# EAGLE design IRC2K16 (EAGLE 6.1)

## Sheet 1 of 2
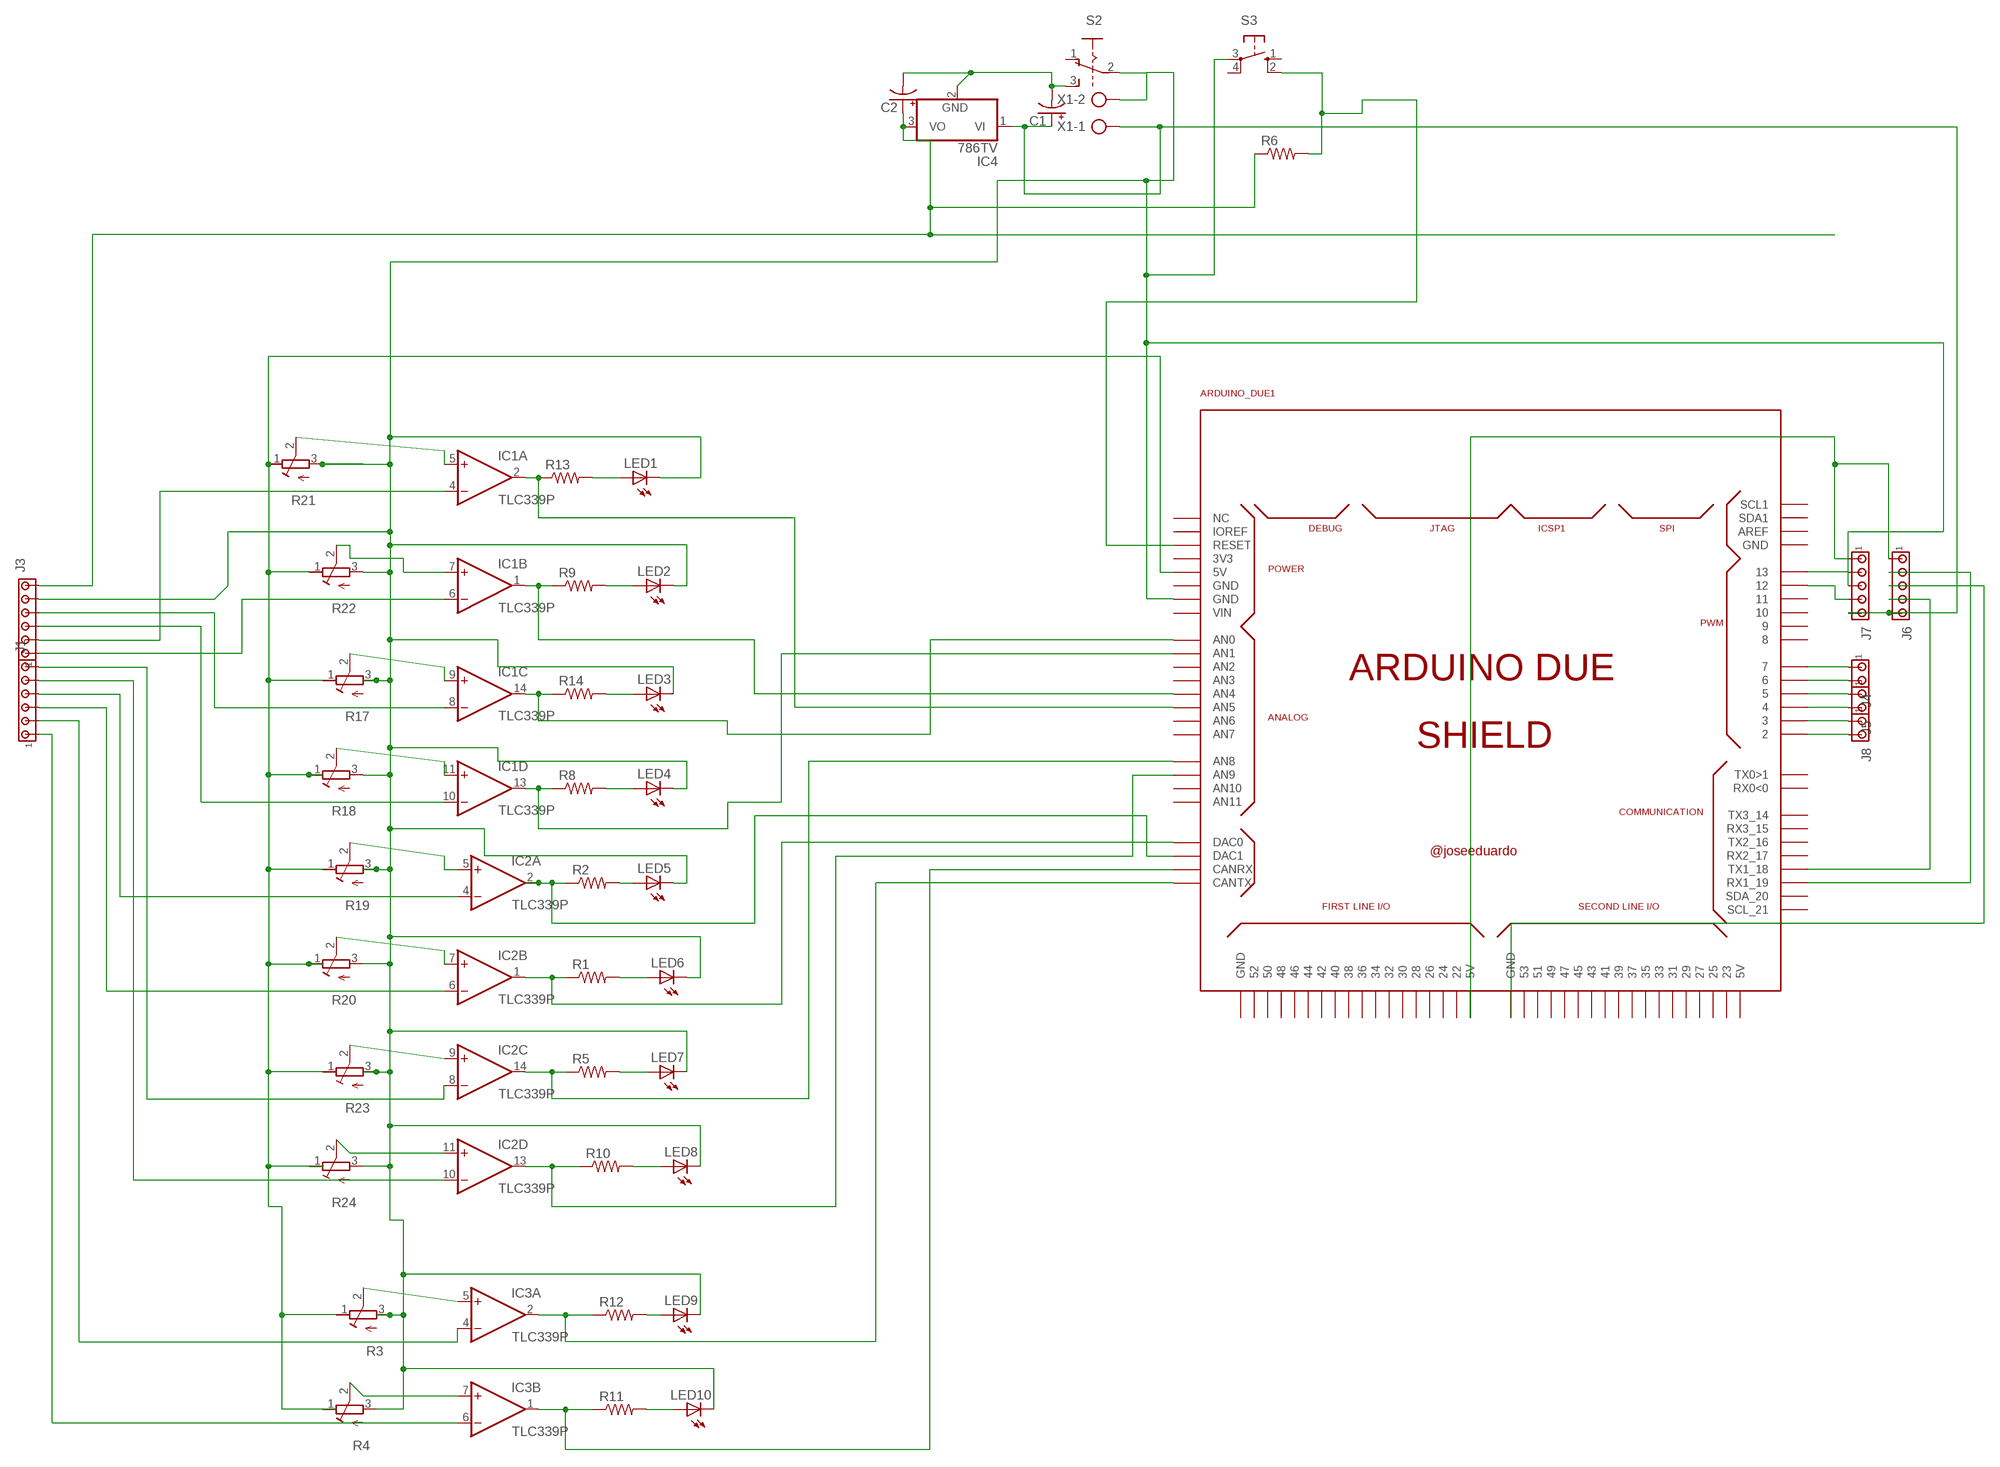
[diagram p0: schematic, sheet 1]

### Parts
ARDUINO_DUE1  ARDUINO_DUE_SHIELD  [ARDUINO_DUE_SHIELD]
C1  CPOL-USE5-10.5  [E5-10,5]
C2  CPOL-USE5-10.5  [E5-10,5]
IC1  TLC339P  [DIL14]
IC2  TLC339P  [DIL14]
IC3  TLC339P  [DIL14]
IC4  786TV  [TO220V]
J1  MTA06-100  [10X06MTA]
J3  MTA06-100  [10X06MTA]
J4  MTA02-100  [10X02MTA]
J5  MTA02-100  [10X02MTA]
J6  MTA05-100  [10X05MTA]
J7  MTA05-100  [10X05MTA]
J8  MTA02-100  [10X02MTA]
LED1  LED3MM  [LED3MM]
LED2  LED3MM  [LED3MM]
LED3  LED3MM  [LED3MM]
LED4  LED3MM  [LED3MM]
LED5  LED3MM  [LED3MM]
LED6  LED3MM  [LED3MM]
LED7  LED3MM  [LED3MM]
LED8  LED3MM  [LED3MM]
LED9  LED3MM  [LED3MM]
LED10  LED3MM  [LED3MM]
R1  R-US_0411/3V  [0411V]
R2  R-US_0411/3V  [0411V]
R3  R-TRIMMT93YA  [RTRIMT93YA]
R4  R-TRIMMT93YA  [RTRIMT93YA]
R5  R-US_0411/3V  [0411V]
R6  R-US_0207/10  [0207/10]
R8  R-US_0411/3V  [0411V]
R9  R-US_0411/3V  [0411V]
R10  R-US_0411/3V  [0411V]
R11  R-US_0411/3V  [0411V]
R12  R-US_0411/3V  [0411V]
R13  R-US_0411/3V  [0411V]
R14  R-US_0411/3V  [0411V]
R17  R-TRIMMT93YA  [RTRIMT93YA]
R18  R-TRIMMT93YA  [RTRIMT93YA]
R19  R-TRIMMT93YA  [RTRIMT93YA]
R20  R-TRIMMT93YA  [RTRIMT93YA]
R21  R-TRIMMT93YA  [RTRIMT93YA]
R22  R-TRIMMT93YA  [RTRIMT93YA]
R23  R-TRIMMT93YA  [RTRIMT93YA]
R24  R-TRIMMT93YA  [RTRIMT93YA]
S2  A68-A31  [A68-A31]
S3  10-XX  [B3F-10XX]
X1  AK300/2  [AK300/2]

### Nets
N$1: ARDUINO_DUE1.7 J4.1
N$2: IC1.4(A:-IN) J3.5
N$3: ARDUINO_DUE1.6 J4.2
N$4: IC1.6(B:-IN) J3.6
N$5: IC1.7(B:+IN) R22.2(S)
N$6: IC1.5(A:+IN) R21.2(S)
N$7: IC1.9(C:+IN) R17.2(S)
N$8: IC1.11(D:+IN) R18.2(S)
N$9: IC2.5(A:+IN) R19.2(S)
N$10: IC2.7(B:+IN) R20.2(S)
N$11: IC2.9(C:+IN) R23.2(S)
N$12: IC2.11(D:+IN) R24.2(S)
N$13: ARDUINO_DUE1.A5(AN5) IC1.2(A:OUT) R13.1
N$14: LED1.A R13.2
N$15: ARDUINO_DUE1.A4(AN4) IC1.1(B:OUT) R9.1
N$16: LED2.A R9.2
N$17: ARDUINO_DUE1.A0(AN0) IC1.14(C:OUT) R14.1
N$18: LED3.A R14.2
N$19: ARDUINO_DUE1.A1(AN1) IC1.13(D:OUT) R8.1
N$20: ARDUINO_DUE1.DAC1 IC2.2(A:OUT) R2.1
N$21: ARDUINO_DUE1.DAC0 IC2.1(B:OUT) R1.1
N$22: ARDUINO_DUE1.A8(AN8) IC2.14(C:OUT) R5.1
N$23: LED4.A R8.2
N$24: LED5.A R2.2
N$25: LED6.A R1.2
N$26: LED7.A R5.2
N$27: ARDUINO_DUE1.A9(AN9) IC2.13(D:OUT) R10.1
N$28: LED8.A R10.2
N$29: IC1.8(C:-IN) J3.3
N$30: ARDUINO_DUE1.5 J5.1
N$31: IC1.10(D:-IN) J3.4
N$32: IC2.4(A:-IN) J1.3
N$33: IC2.6(B:-IN) J1.4
N$34: IC2.8(C:-IN) J1.1
N$35: ARDUINO_DUE1.4 J5.2
N$36: ARDUINO_DUE1.3 J8.1
N$37: ARDUINO_DUE1.2 J8.2
N$38: IC2.10(D:-IN) J1.2
N$39: C1.+ IC4.1(VI) J6.5 J7.5 X1.1
N$40: IC3.5(A:+IN) R3.2(S)
N$41: ARDUINO_DUE1.18(TX1_18) J6.4
N$42: IC3.7(B:+IN) R4.2(S)
N$43: ARDUINO_DUE1.CANTX IC3.2(A:OUT) R12.1
N$44: LED9.A R12.2
N$45: ARDUINO_DUE1.CANRX IC3.1(B:OUT) R11.1
N$46: LED10.A R11.2
N$47: IC3.4(A:-IN) J1.5
N$48: IC3.6(B:-IN) J1.6
N$49: C2.+ IC4.3(VO) J3.1 R6.1
N$51: ARDUINO_DUE1.13 J7.2
N$52: ARDUINO_DUE1.RESET R6.2 S3.2(S1)
N$53: C1.- C2.- IC4.2(GND) S2.3(A:S)
N$54: ARDUINO_DUE1.5V0(5V) R3.1(A) R4.1(A) R17.1(A) R18.1(A) R19.1(A) R20.1(A) R21.1(A) R22.1(A) R23.1(A) R24.1(A)
N$55: ARDUINO_DUE1.5V0_1(5V) J6.1 J7.1
N$56: ARDUINO_DUE1.12 J7.4
N$57: ARDUINO_DUE1.19(RX1_19) J6.2
N$58: ARDUINO_DUE1.GND_3(GND) J6.3
N$59: ARDUINO_DUE1.GND_1(GND) J3.2 J7.3 LED1.K(C) LED2.K(C) LED3.K(C) LED4.K(C) LED5.K(C) LED6.K(C) LED7.K(C) LED8.K(C) LED9.K(C) LED10.K(C) R3.3(E) R4.3(E) R17.3(E) R18.3(E) R19.3(E) R20.3(E) R21.3(E) R22.3(E) R23.3(E) R24.3(E) S2.2(A:P) S3.3(P) X1.2
Unconnected: ARDUINO_DUE1.0(RX0<0) ARDUINO_DUE1.1(TX0>1) ARDUINO_DUE1.3V3 ARDUINO_DUE1.5V0_2(5V) ARDUINO_DUE1.8 ARDUINO_DUE1.9 ARDUINO_DUE1.10 ARDUINO_DUE1.11 ARDUINO_DUE1.14(TX3_14) ARDUINO_DUE1.15(RX3_15) ARDUINO_DUE1.16(TX2_16) ARDUINO_DUE1.17(RX2_17) ARDUINO_DUE1.20(SDA_20) ARDUINO_DUE1.21(SCL_21) ARDUINO_DUE1.22 ARDUINO_DUE1.23 ARDUINO_DUE1.24 ARDUINO_DUE1.25 ARDUINO_DUE1.26 ARDUINO_DUE1.27 ARDUINO_DUE1.28 ARDUINO_DUE1.29 ARDUINO_DUE1.30 ARDUINO_DUE1.31 ARDUINO_DUE1.32 ARDUINO_DUE1.33 ARDUINO_DUE1.34 ARDUINO_DUE1.35 ARDUINO_DUE1.36 ARDUINO_DUE1.37 ARDUINO_DUE1.38 ARDUINO_DUE1.39 ARDUINO_DUE1.40 ARDUINO_DUE1.41 ARDUINO_DUE1.42 ARDUINO_DUE1.43 ARDUINO_DUE1.44 ARDUINO_DUE1.45 ARDUINO_DUE1.46 ARDUINO_DUE1.47 ARDUINO_DUE1.48 ARDUINO_DUE1.49 ARDUINO_DUE1.50 ARDUINO_DUE1.51 ARDUINO_DUE1.52 ARDUINO_DUE1.53 ARDUINO_DUE1.A2(AN2) ARDUINO_DUE1.A3(AN3) ARDUINO_DUE1.A6(AN6) ARDUINO_DUE1.A7(AN7) ARDUINO_DUE1.A10(AN10) ARDUINO_DUE1.A11(AN11) ARDUINO_DUE1.AREF ARDUINO_DUE1.GND ARDUINO_DUE1.GND_2(GND) ARDUINO_DUE1.GND_4(GND) ARDUINO_DUE1.IOREF ARDUINO_DUE1.NC_2(NC) ARDUINO_DUE1.SCL1 ARDUINO_DUE1.SDA1 ARDUINO_DUE1.VIN IC3.8(C:-IN) IC3.9(C:+IN) IC3.10(D:-IN) IC3.11(D:+IN) IC3.13(D:OUT) IC3.14(C:OUT) S2.1(A:O) S2.4(B:O) S2.5(B:P) S2.6(B:S) S3.1(S) S3.4(P1)

## Sheet 2 of 2
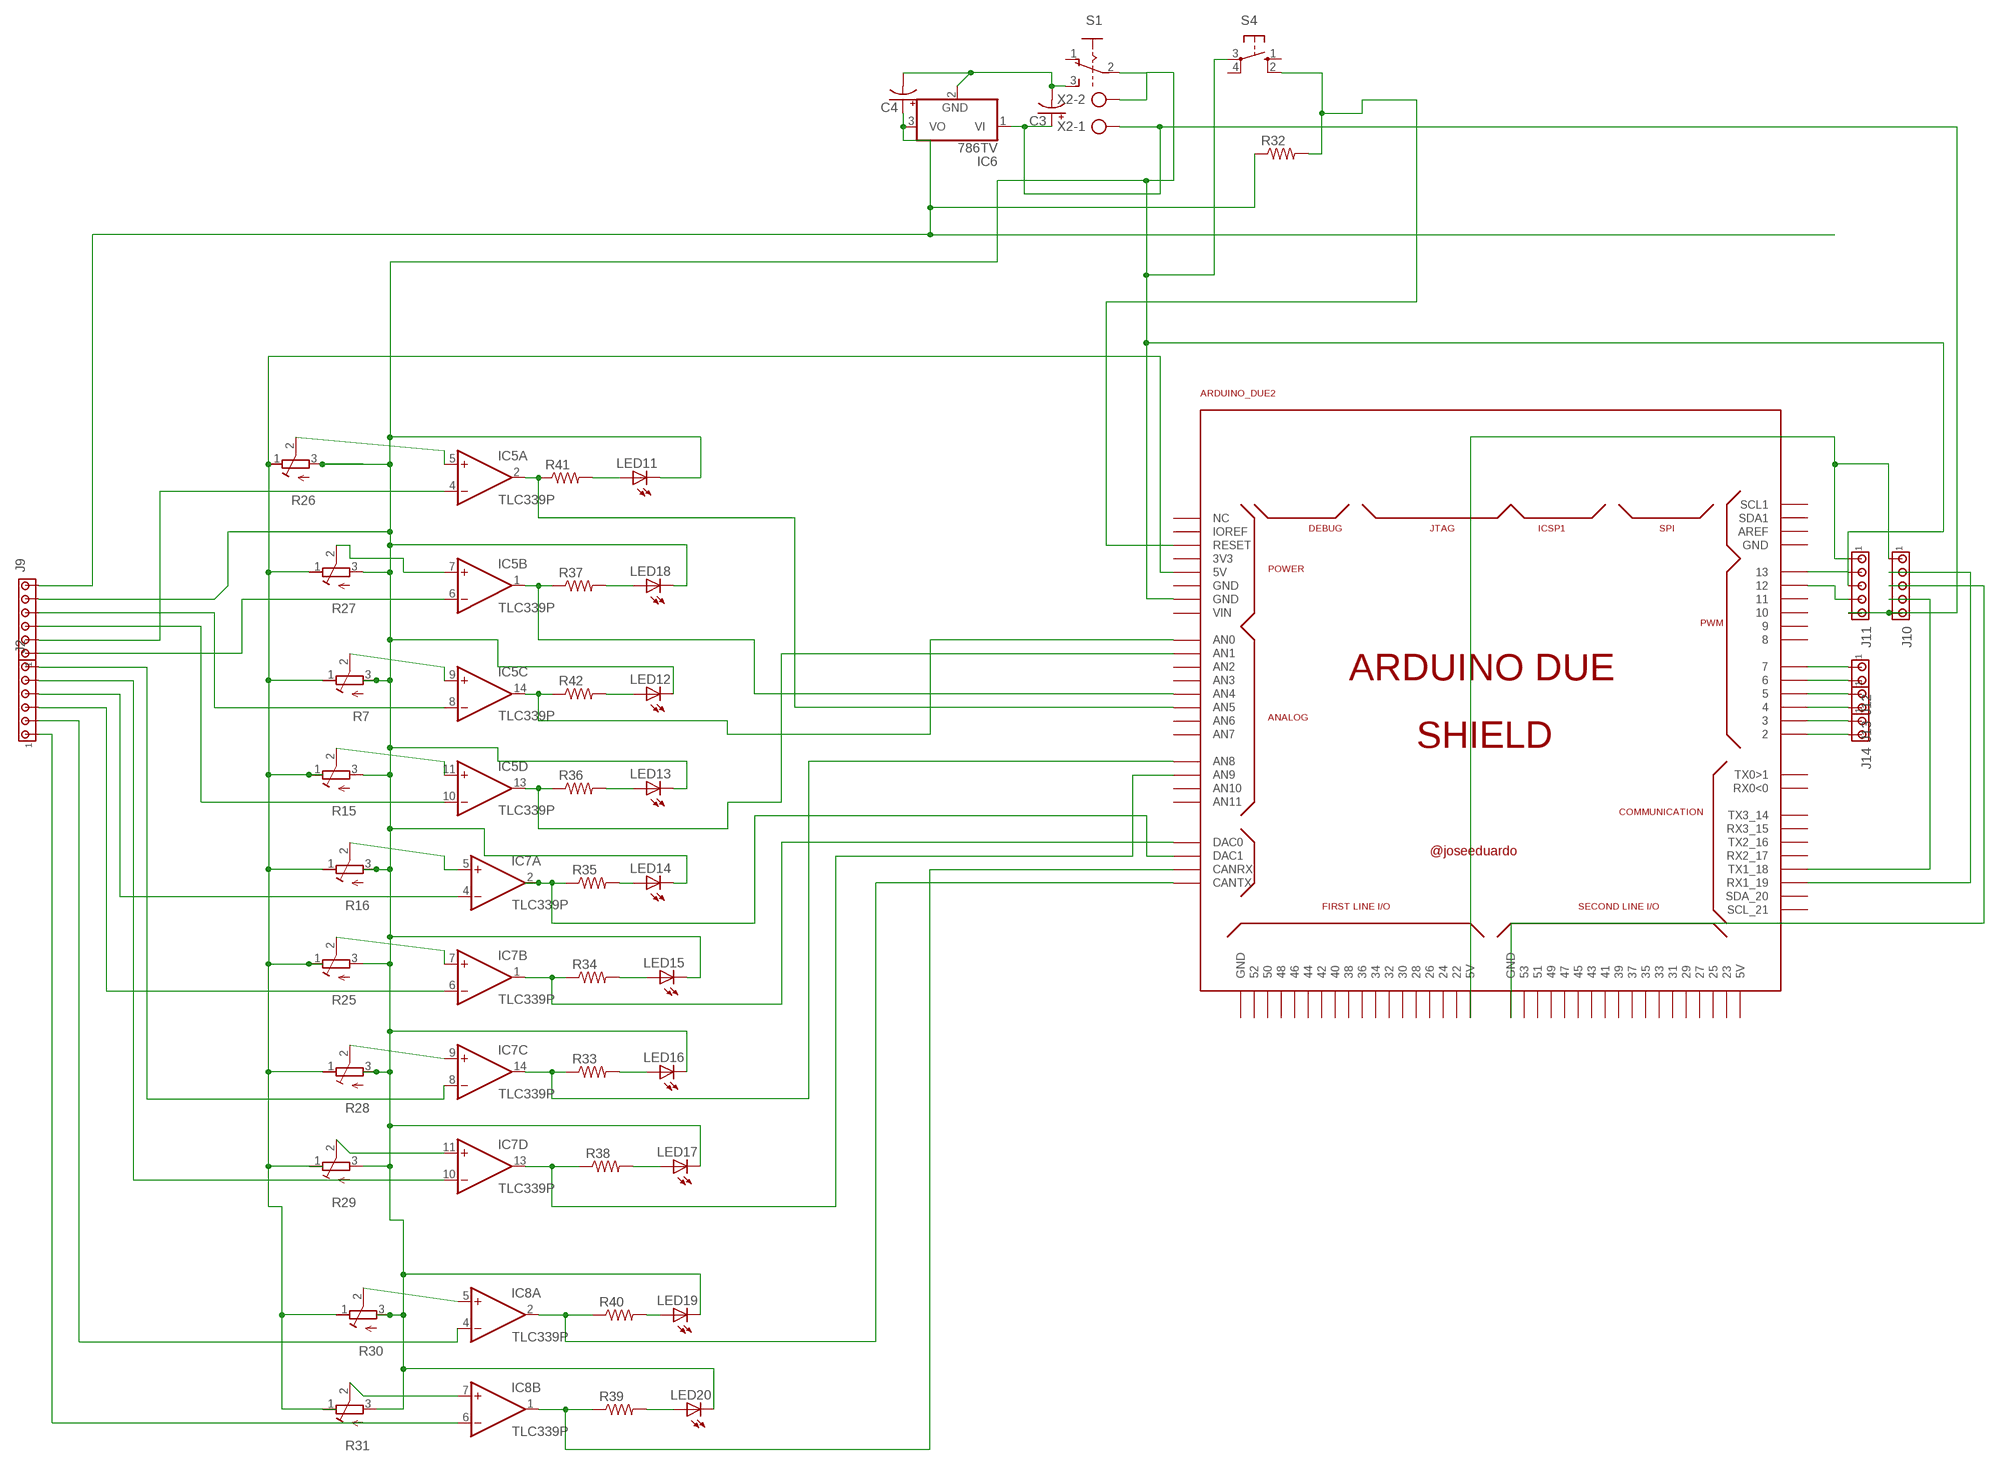
[diagram p1: schematic, sheet 2]

### Parts
ARDUINO_DUE2  ARDUINO_DUE_SHIELD  [ARDUINO_DUE_SHIELD]
C3  CPOL-USE5-10.5  [E5-10,5]
C4  CPOL-USE5-10.5  [E5-10,5]
IC5  TLC339P  [DIL14]
IC6  786TV  [TO220V]
IC7  TLC339P  [DIL14]
IC8  TLC339P  [DIL14]
J2  MTA06-100  [10X06MTA]
J9  MTA06-100  [10X06MTA]
J10  MTA05-100  [10X05MTA]
J11  MTA05-100  [10X05MTA]
J12  MTA02-100  [10X02MTA]
J13  MTA02-100  [10X02MTA]
J14  MTA02-100  [10X02MTA]
LED11  LED3MM  [LED3MM]
LED12  LED3MM  [LED3MM]
LED13  LED3MM  [LED3MM]
LED14  LED3MM  [LED3MM]
LED15  LED3MM  [LED3MM]
LED16  LED3MM  [LED3MM]
LED17  LED3MM  [LED3MM]
LED18  LED3MM  [LED3MM]
LED19  LED3MM  [LED3MM]
LED20  LED3MM  [LED3MM]
R7  R-TRIMMT93YA  [RTRIMT93YA]
R15  R-TRIMMT93YA  [RTRIMT93YA]
R16  R-TRIMMT93YA  [RTRIMT93YA]
R25  R-TRIMMT93YA  [RTRIMT93YA]
R26  R-TRIMMT93YA  [RTRIMT93YA]
R27  R-TRIMMT93YA  [RTRIMT93YA]
R28  R-TRIMMT93YA  [RTRIMT93YA]
R29  R-TRIMMT93YA  [RTRIMT93YA]
R30  R-TRIMMT93YA  [RTRIMT93YA]
R31  R-TRIMMT93YA  [RTRIMT93YA]
R32  R-US_0207/10  [0207/10]
R33  R-US_0411/3V  [0411V]
R34  R-US_0411/3V  [0411V]
R35  R-US_0411/3V  [0411V]
R36  R-US_0411/3V  [0411V]
R37  R-US_0411/3V  [0411V]
R38  R-US_0411/3V  [0411V]
R39  R-US_0411/3V  [0411V]
R40  R-US_0411/3V  [0411V]
R41  R-US_0411/3V  [0411V]
R42  R-US_0411/3V  [0411V]
S1  A68-A31  [A68-A31]
S4  10-XX  [B3F-10XX]
X2  AK300/2  [AK300/2]

### Nets
N$60: IC5.7(B:+IN) R27.2(S)
N$61: IC5.5(A:+IN) R26.2(S)
N$62: IC5.9(C:+IN) R7.2(S)
N$63: IC5.11(D:+IN) R15.2(S)
N$64: IC7.5(A:+IN) R16.2(S)
N$65: IC7.7(B:+IN) R25.2(S)
N$66: IC7.9(C:+IN) R28.2(S)
N$67: IC7.11(D:+IN) R29.2(S)
N$68: ARDUINO_DUE2.A5(AN5) IC5.2(A:OUT) R41.1
N$69: ARDUINO_DUE2.A4(AN4) IC5.1(B:OUT) R37.1
N$70: ARDUINO_DUE2.A0(AN0) IC5.14(C:OUT) R42.1
N$71: LED12.A R42.2
N$72: ARDUINO_DUE2.A1(AN1) IC5.13(D:OUT) R36.1
N$73: ARDUINO_DUE2.DAC1 IC7.2(A:OUT) R35.1
N$74: ARDUINO_DUE2.DAC0 IC7.1(B:OUT) R34.1
N$75: ARDUINO_DUE2.A8(AN8) IC7.14(C:OUT) R33.1
N$76: LED13.A R36.2
N$77: LED14.A R35.2
N$78: LED15.A R34.2
N$79: LED16.A R33.2
N$80: ARDUINO_DUE2.A9(AN9) IC7.13(D:OUT) R38.1
N$81: LED17.A R38.2
N$82: LED11.A R41.2
N$83: LED18.A R37.2
N$84: IC5.4(A:-IN) J9.5
N$85: IC5.6(B:-IN) J9.6
N$86: IC5.10(D:-IN) J9.4
N$87: IC7.8(C:-IN) J2.1
N$88: IC7.10(D:-IN) J2.2
N$89: ARDUINO_DUE2.7 J12.1
N$90: ARDUINO_DUE2.6 J12.2
N$91: ARDUINO_DUE2.5 J13.1
N$92: ARDUINO_DUE2.4 J13.2
N$93: ARDUINO_DUE2.3 J14.1
N$94: ARDUINO_DUE2.2 J14.2
N$95: C3.+ IC6.1(VI) J10.5 J11.5 X2.1
N$96: IC8.5(A:+IN) R30.2(S)
N$97: IC8.7(B:+IN) R31.2(S)
N$98: ARDUINO_DUE2.CANTX IC8.2(A:OUT) R40.1
N$99: LED19.A R40.2
N$100: ARDUINO_DUE2.CANRX IC8.1(B:OUT) R39.1
N$101: LED20.A R39.2
N$102: IC8.4(A:-IN) J2.5
N$103: IC8.6(B:-IN) J2.6
N$104: C4.+ IC6.3(VO) J9.1 R32.1
N$105: ARDUINO_DUE2.RESET R32.2 S4.2(S1)
N$106: IC7.6(B:-IN) J2.4
N$107: IC7.4(A:-IN) J2.3
N$108: IC5.8(C:-IN) J9.3
N$109: C3.- C4.- IC6.2(GND) S1.3(A:S)
N$110: ARDUINO_DUE2.GND_1(GND) J9.2 J11.3 LED11.K(C) LED12.K(C) LED13.K(C) LED14.K(C) LED15.K(C) LED16.K(C) LED17.K(C) LED18.K(C) LED19.K(C) LED20.K(C) R7.3(E) R15.3(E) R16.3(E) R25.3(E) R26.3(E) R27.3(E) R28.3(E) R29.3(E) R30.3(E) R31.3(E) S1.2(A:P) S4.3(P) X2.2
N$111: ARDUINO_DUE2.5V0(5V) R7.1(A) R15.1(A) R16.1(A) R25.1(A) R26.1(A) R27.1(A) R28.1(A) R29.1(A) R30.1(A) R31.1(A)
N$112: ARDUINO_DUE2.5V0_1(5V) J10.1 J11.1
N$113: ARDUINO_DUE2.13 J11.2
N$114: ARDUINO_DUE2.12 J11.4
N$115: ARDUINO_DUE2.18(TX1_18) J10.4
N$116: ARDUINO_DUE2.19(RX1_19) J10.2
N$117: ARDUINO_DUE2.GND_3(GND) J10.3
Unconnected: ARDUINO_DUE2.0(RX0<0) ARDUINO_DUE2.1(TX0>1) ARDUINO_DUE2.3V3 ARDUINO_DUE2.5V0_2(5V) ARDUINO_DUE2.8 ARDUINO_DUE2.9 ARDUINO_DUE2.10 ARDUINO_DUE2.11 ARDUINO_DUE2.14(TX3_14) ARDUINO_DUE2.15(RX3_15) ARDUINO_DUE2.16(TX2_16) ARDUINO_DUE2.17(RX2_17) ARDUINO_DUE2.20(SDA_20) ARDUINO_DUE2.21(SCL_21) ARDUINO_DUE2.22 ARDUINO_DUE2.23 ARDUINO_DUE2.24 ARDUINO_DUE2.25 ARDUINO_DUE2.26 ARDUINO_DUE2.27 ARDUINO_DUE2.28 ARDUINO_DUE2.29 ARDUINO_DUE2.30 ARDUINO_DUE2.31 ARDUINO_DUE2.32 ARDUINO_DUE2.33 ARDUINO_DUE2.34 ARDUINO_DUE2.35 ARDUINO_DUE2.36 ARDUINO_DUE2.37 ARDUINO_DUE2.38 ARDUINO_DUE2.39 ARDUINO_DUE2.40 ARDUINO_DUE2.41 ARDUINO_DUE2.42 ARDUINO_DUE2.43 ARDUINO_DUE2.44 ARDUINO_DUE2.45 ARDUINO_DUE2.46 ARDUINO_DUE2.47 ARDUINO_DUE2.48 ARDUINO_DUE2.49 ARDUINO_DUE2.50 ARDUINO_DUE2.51 ARDUINO_DUE2.52 ARDUINO_DUE2.53 ARDUINO_DUE2.A2(AN2) ARDUINO_DUE2.A3(AN3) ARDUINO_DUE2.A6(AN6) ARDUINO_DUE2.A7(AN7) ARDUINO_DUE2.A10(AN10) ARDUINO_DUE2.A11(AN11) ARDUINO_DUE2.AREF ARDUINO_DUE2.GND ARDUINO_DUE2.GND_2(GND) ARDUINO_DUE2.GND_4(GND) ARDUINO_DUE2.IOREF ARDUINO_DUE2.NC_2(NC) ARDUINO_DUE2.SCL1 ARDUINO_DUE2.SDA1 ARDUINO_DUE2.VIN IC8.8(C:-IN) IC8.9(C:+IN) IC8.10(D:-IN) IC8.11(D:+IN) IC8.13(D:OUT) IC8.14(C:OUT) S1.1(A:O) S1.4(B:O) S1.5(B:P) S1.6(B:S) S4.1(S) S4.4(P1)

## Power pins joined to a net without a drawn wire
N$54: IC1.3(P:V+) IC2.3(P:V+) IC3.3(P:V+)
N$111: IC5.3(P:V+) IC7.3(P:V+) IC8.3(P:V+)
V-: IC1.12(P:V-) IC2.12(P:V-) IC3.12(P:V-)
V-1: IC5.12(P:V-) IC7.12(P:V-) IC8.12(P:V-)

## Library data of the parts
ARDUINO_DUE1 ARDUINO_DUE2 = arduino_due_shield:ARDUINO_DUE_SHIELD
C1-C4 = adafruit:CPOL-US: POLARIZED CAPACITOR, American symbol
IC1-IC3 IC5 IC7 IC8 = linear:TLC339: COMPARATOR
IC4 IC6 = linear:78*: Positive VOLTAGE REGULATOR Source: http://cache.national.com/ds/LM/LM78L05.pdf http://www.fairchildsemi.com/ds/LM/LM7805.pdf
J1-J3 J9 = con-amp:MTA06-100: AMP connector
J4 J5 J8 J12-J14 = con-amp:MTA02-100: AMP connector
J6 J7 J10 J11 = con-amp:MTA05-100: AMP connector
LED1-LED20 = adafruit:LED: LED OSRAM: - CHIPLED LG R971, LG N971, LY N971, LG Q971, LY Q971, LO R971, LY R971 LH N974, LH R974 LS Q976, LO Q976, LY Q976 LO Q996 - Hyper CHIPLED LW Q18S LB Q993, LB Q99A, LB R99A - SideLED LS A670, LO A670, LY A670, LG A670, LP A670 LB A673, LV A673, LT A673, LW A673 LH A674 LY A675 LS A676, LA A676, LO A676, LY A676, LW A676 LS A679, LY A679, LG A679 - Hyper Micro SIDELED® LS Y876, LA Y876, LO Y876, LY Y876 LT Y87S - SmartLED LW L88C, LW L88S LB L89C, LB L89S, LG L890 LS L89K, LO L89K, LY L89K LS L896, LA L896, LO L896, LY L896 - TOPLED LS T670, LO T670, LY T670, LG T670, LP T670 LSG T670, LSP T670, LSY T670, LOP T670, LYG T670 LG T671, LOG T671, LSG T671 LB T673, LV T673, LT T673, LW T673 LH T674 LS T676, LA T676, LO T676, LY T676, LB T676, LH T676, LSB T676, LW T676 LB T67C, LV T67C, LT T67C, LS T67K, LO T67K, LY T67K, LW E67C LS E67B, LA E67B, LO E67B, LY E67B, LB E67C, LV E67C, LT E67C LW T67C LS T679, LY T679, LG T679 LS T770, LO T770, LY T770, LG T770, LP T770 LB T773, LV T773, LT T773, LW T773 LH T774 LS E675, LA E675, LY E675, LS T675 LS T776, LA T776, LO T776, LY T776, LB T776 LHGB T686 LT T68C, LB T68C - Hyper Mini TOPLED® LB M676 - Mini TOPLED Santana® LG M470 LS M47K, LO M47K, LY M47K Source: http://www.osram.convergy.de/
R1 R2 R5 R8-R14 R33-R42 = resistor:R-US_: RESISTOR, American symbol
R3 R4 R7 R15-R31 = rcl:R-TRIMM: Trimm resistor
R6 R32 = adafruit:R-US_: RESISTOR, American symbol
S1 S2 = switch:A68-A31: SLIDING SWITCH Siemens, distributor Buerklin, 11G766
S3 S4 = switch-omron:10-XX: OMRON SWITCH; MPN: B3F-1000; OC_FARNELL: 176432; OC_NEWARK: 36M3542
X1 X2 = con-ptr500:AK300/2: CONNECTOR

## Board
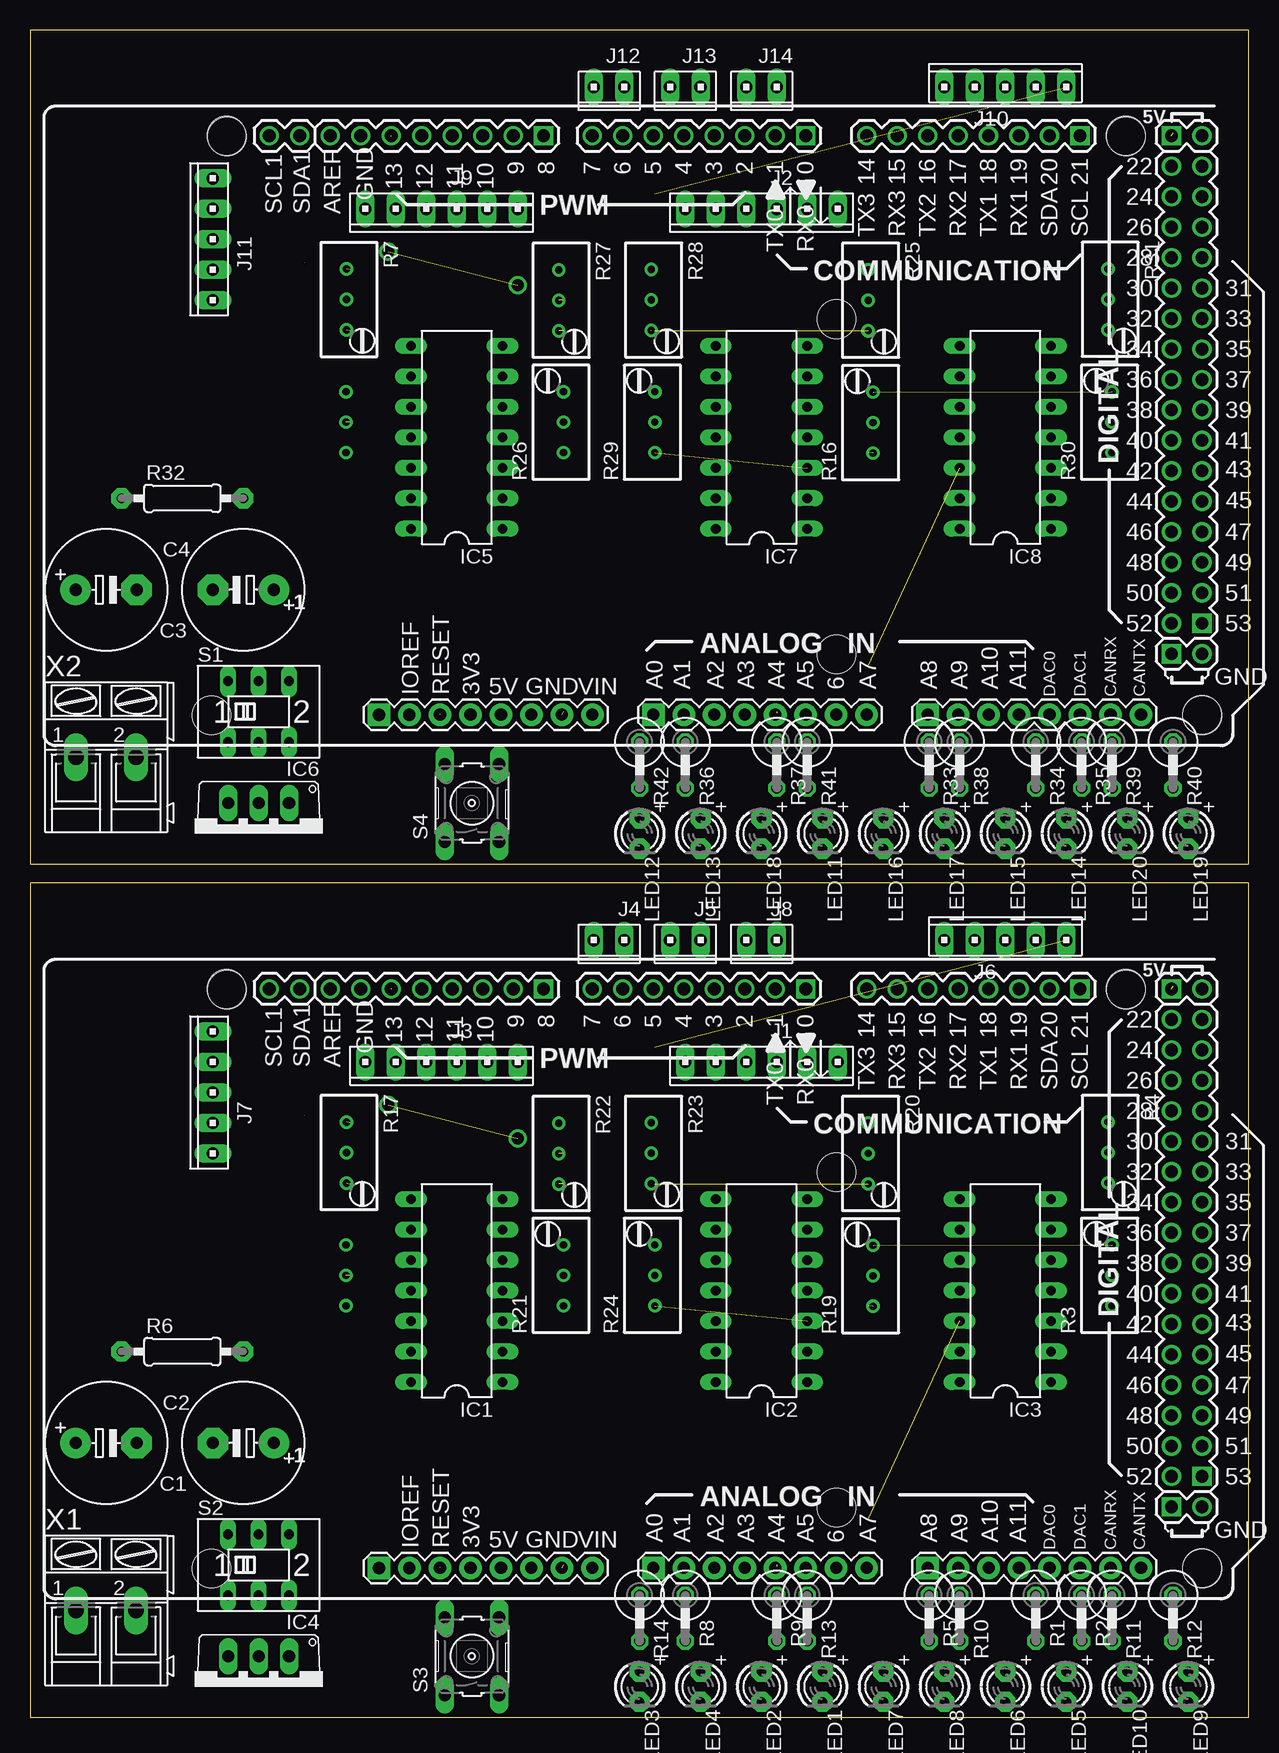
[diagram p2: board, top side]
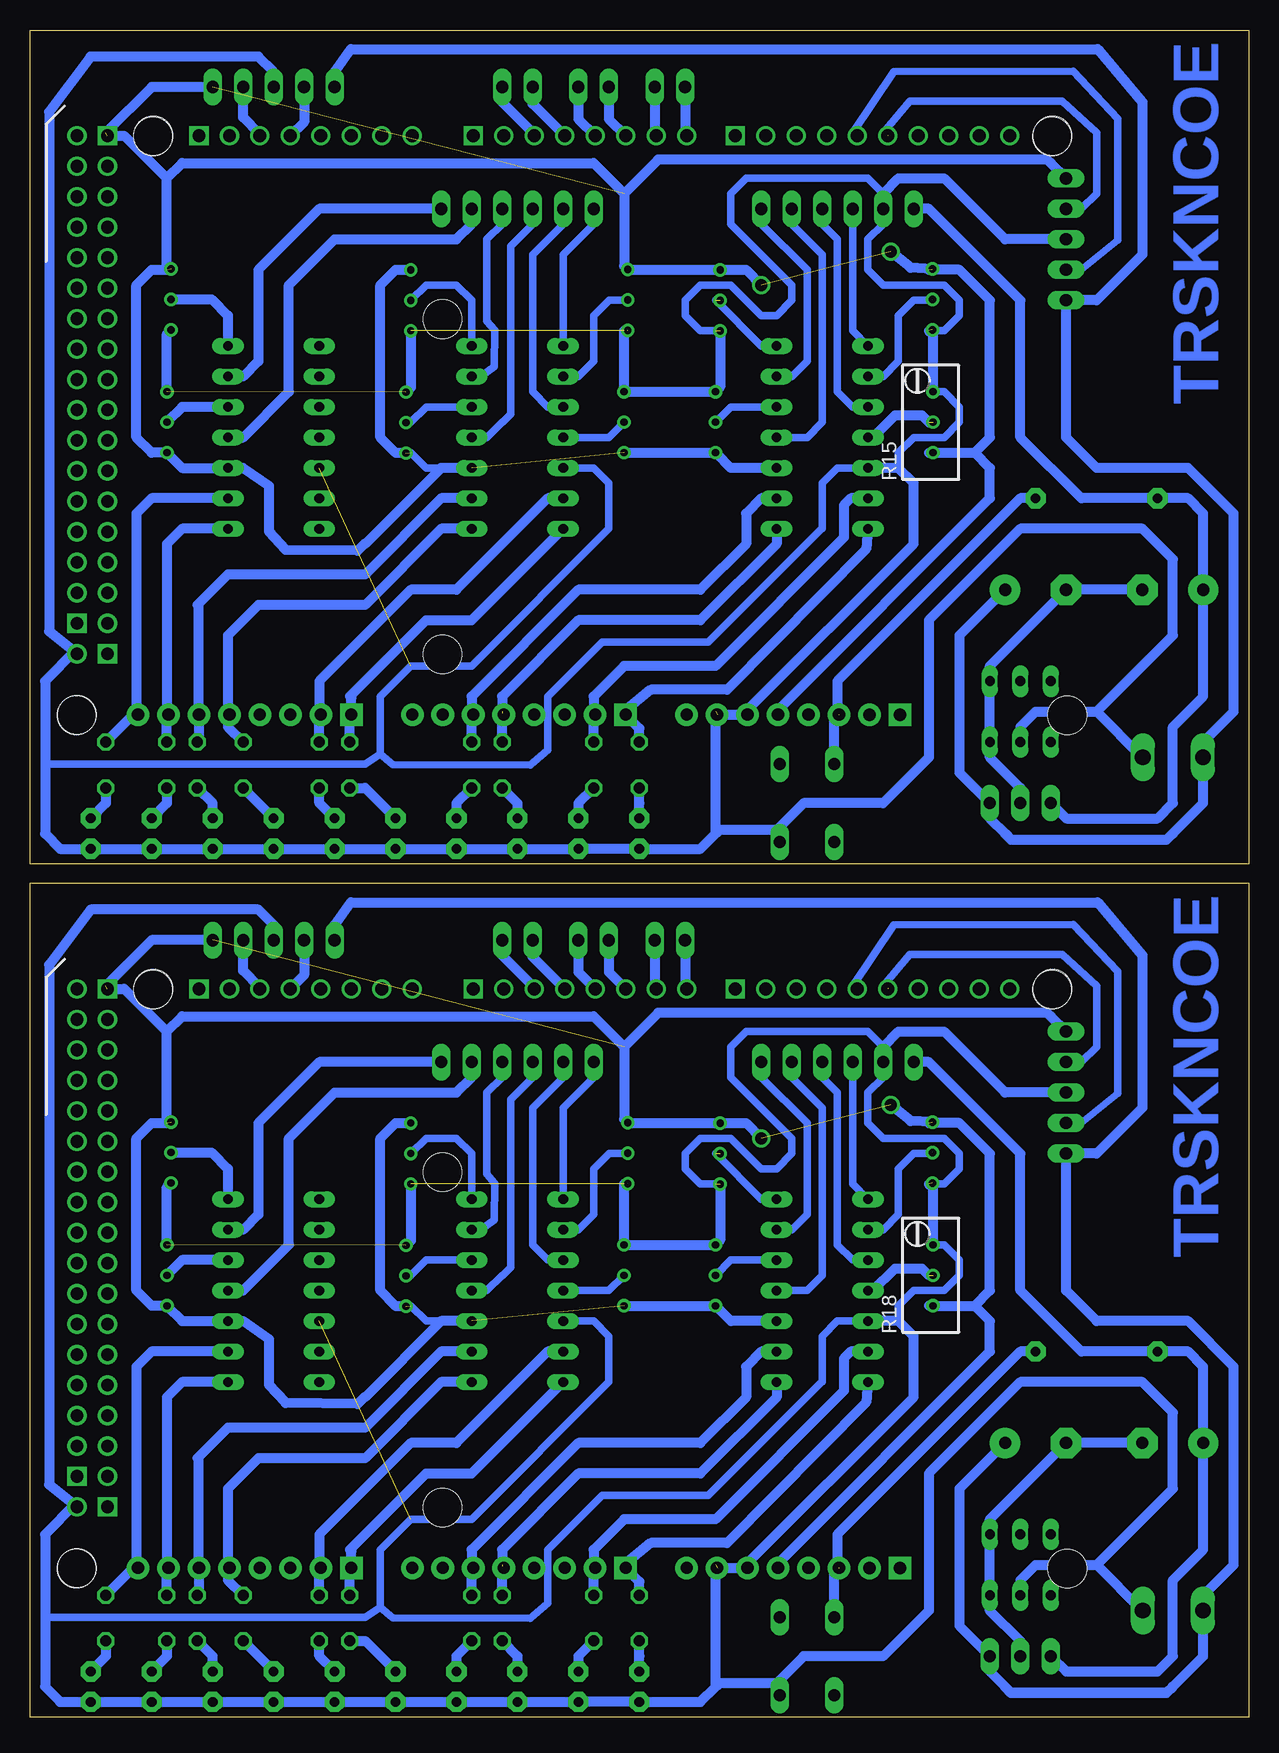
[diagram p3: board, bottom side, seen from below]

Size 101.58 x 140.64 mm. Coordinates in mm from the lower left corner, seen from the top.
Outline: 0,0 101.58,0 101.58,69.52 0,69.52 0,0
Outline: 0,71.12 101.58,71.12 101.58,140.64 0,140.64 0,71.12
Copper layers (1*16): Top 0.035mm / dielectric 1.5mm / Bottom 0.035mm
Design rules: minimum track width 10mil, minimum drill 24mil, track to track 8mil, track to pad 8mil, pad to pad 8mil, via to via 8mil, smd to smd 8mil, copper to edge 40mil, drill to drill 8mil, minimum pad ring 10mil, minimum via ring 8mil, stop-mask expansion 4mil, vias tented up to drill 0mil, thermal gap 10mil

### Footprints (pad centres in the part's own frame; a part is rotated, then mirrored left to right if it is on the bottom)
ARDUINO_DUE_SHIELD = drill 1.067 square: 0 63.373,51.816; 5V0_1 93.853,51.816; 8 41.529,51.816; 21 86.233,51.816; 53 96.393,11.176; GND_2 93.853,8.636 | drill 1.067: 1 60.833,51.816; 2 58.293,51.816; 3 55.753,51.816; 4 53.213,51.816; 5 50.673,51.816; 5V0_2 96.393,51.816; 6 48.133,51.816; 7 45.593,51.816; 9 38.989,51.816; 10 36.449,51.816; 11 33.909,51.816; 12 31.369,51.816; 13 28.829,51.816; 14 68.453,51.816; 15 70.993,51.816; 16 73.533,51.816; 17 76.073,51.816; 18 78.613,51.816; 19 81.153,51.816; 20 83.693,51.816; 22 93.853,49.276; 23 96.393,49.276; 24 93.853,46.736; 25 96.393,46.736; 26 93.853,44.196; 27 96.393,44.196; 28 93.853,41.656; 29 96.393,41.656; 30 93.853,39.116; 31 96.393,39.116; 32 93.853,36.576; 33 96.393,36.576; 34 93.853,34.036; 35 96.393,34.036; 36 93.853,31.496; 37 96.393,31.496; 38 93.853,28.956; 39 96.393,28.956; 40 93.853,26.416; 41 96.393,26.416; 42 93.853,23.876; 43 96.393,23.876; 44 93.853,21.336; 45 96.393,21.336; 46 93.853,18.796; 47 96.393,18.796; 48 93.853,16.256; 49 96.393,16.256; 50 93.853,13.716; 51 96.393,13.716; 52 93.853,11.176; AREF 23.749,51.816; GND_3 96.393,8.636; GND_4 26.289,51.816; SCL1 18.669,51.816; SDA1 21.209,51.816 | drill 1.016 pad 1.88: 3V3 35.433,3.556; 5V0 37.973,3.556; A1 53.213,3.556; A2 55.753,3.556; A3 58.293,3.556; A4 60.833,3.556; A5 63.373,3.556; A6 65.913,3.556; A7 68.453,3.556; A9 76.073,3.556; A10 78.613,3.556; A11 81.153,3.556; CANRX 88.773,3.556; CANTX 91.313,3.556; DAC0 83.693,3.556; DAC1 86.233,3.556; GND 40.513,3.556; GND_1 43.053,3.556; IOREF 30.346,3.543; RESET 32.893,3.555; VIN 45.593,3.556 | drill 1.016 pad 1.88 square: A0 50.673,3.556; A8 73.533,3.556; NC_2 27.806,3.543 | hole 3.2: 15.113,51.816; 90.043,51.816; 96.393,3.556; 96.418,3.505; 15.138,51.765; 90.068,51.765; 13.868,3.505; 65.938,36.525; 65.938,8.585
E5-10,5 = drill 1.016 pad 2.54: + -2.54,0 | drill 1.016 pad 2.54 octagon: - 2.54,0
DIL14 = drill 0.813 long: 1 -7.62,-3.81; 2 -5.08,-3.81; 3 -2.54,-3.81; 4 0,-3.81; 5 2.54,-3.81; 6 5.08,-3.81; 7 7.62,-3.81; 8 7.62,3.81; 9 5.08,3.81; 10 2.54,3.81; 11 0,3.81; 12 -2.54,3.81; 13 -5.08,3.81; 14 -7.62,3.81
TO220V = drill 1.016 long: 1 -2.54,-2.54; 2 0,-2.54; 3 2.54,-2.54
10X06MTA = drill 1.016 long: 1 6.35,0; 2 3.81,0; 3 1.27,0; 4 -1.27,0; 5 -3.81,0; 6 -6.35,0
10X02MTA = drill 1.016 long: 1 1.27,0; 2 -1.27,0
10X05MTA = drill 1.016 long: 1 5.08,0; 2 2.54,0; 3 0,0; 4 -2.54,0; 5 -5.08,0
LED3MM = drill 0.813 pad 1.676 octagon: A -1.27,0; K 1.27,0
0411V = drill 0.914 octagon: 1 -2.54,0; 2 1.27,0
RTRIMT93YA = drill 0.61: 1 0,-2.54; 2 0,0; 3 0,2.54
0207/10 = drill 0.813 pad 1.676 octagon: 1 -5.08,0; 2 5.08,0
A68-A31 = drill 0.813 long: 1 -2.54,-2.54; 2 0,-2.54; 3 2.54,-2.54; 4 -2.54,2.54; 5 0,2.54; 6 2.54,2.54
B3F-10XX = drill 1.016 long: 1 -3.251,2.261; 2 3.251,2.261; 3 -3.251,-2.261; 4 3.251,-2.261
AK300/2 = drill 1.321 long: 1 -2.515,0; 2 2.489,0

### Placement (x,y rotation side)
ARDUINO_DUE1  1.27,8.89 0 top
ARDUINO_DUE2  1.27,80.01 0 top
C1  17.78,22.86 180 top
C2  6.35,22.86 0 top
C3  17.78,93.98 180 top
C4  6.35,93.98 0 top
IC1  35.56,35.56 90 top
IC2  60.96,35.56 90 top
IC3  81.28,35.56 90 top
IC4  19.05,2.54 180 top
IC5  35.56,106.68 90 top
IC6  19.05,73.66 180 top
IC7  60.96,106.68 90 top
IC8  81.28,106.68 90 top
J1  60.96,54.61 180 top
J2  60.96,125.73 180 top
J3  34.29,54.61 180 top
J4  48.26,64.77 180 top
J5  54.61,64.77 180 top
J6  81.28,64.77 0 top
J7  15.24,52.07 90 top
J8  60.96,64.77 180 top
J9  34.29,125.73 180 top
J10  81.28,135.89 0 top
J11  15.24,123.19 90 top
J12  48.26,135.89 180 top
J13  54.61,135.89 180 top
J14  60.96,135.89 180 top
LED1  66.04,2.54 270 top
LED2  60.96,2.54 270 top
LED3  50.8,2.54 270 top
LED4  55.88,2.54 270 top
LED5  86.36,2.54 270 top
LED6  81.28,2.54 270 top
LED7  71.12,2.54 270 top
LED8  76.2,2.54 270 top
LED9  96.52,2.54 270 top
LED10  91.44,2.54 270 top
LED11  66.04,73.66 270 top
LED12  50.8,73.66 270 top
LED13  55.88,73.66 270 top
LED14  86.36,73.66 270 top
LED15  81.28,73.66 270 top
LED16  71.12,73.66 270 top
LED17  76.2,73.66 270 top
LED18  60.96,73.66 270 top
LED19  96.52,73.66 270 top
LED20  91.44,73.66 270 top
R1  83.82,7.62 270 top
R2  87.63,7.62 270 top
R3  90.17,36.83 0 top
R4  89.82,47.07 180 top
R5  74.93,7.62 270 top
R6  12.7,30.48 0 top
R7  26.38,118.18 180 top
R8  54.61,7.62 270 top
R9  62.23,7.62 270 top
R10  77.47,7.62 270 top
R11  90.17,7.62 270 top
R12  95.25,7.62 270 top
R13  64.77,7.62 270 top
R14  50.8,7.62 270 top
R15  26.33,107.95 0 bottom
R16  70.25,107.91 0 top
R17  26.38,47.06 180 top
R18  26.33,36.83 0 bottom
R19  70.25,36.79 0 top
R20  69.85,46.99 180 top
R21  44.45,36.83 0 top
R22  44.07,46.98 180 top
R23  51.77,47.01 180 top
R24  52.07,36.83 0 top
R25  69.85,118.11 180 top
R26  44.45,107.95 0 top
R27  44.07,118.1 180 top
R28  51.77,118.13 180 top
R29  52.07,107.95 0 top
R30  90.17,107.95 0 top
R31  89.82,118.19 180 top
R32  12.7,101.6 0 top
R33  74.93,78.74 270 top
R34  83.82,78.74 270 top
R35  87.63,78.74 270 top
R36  54.61,78.74 270 top
R37  62.23,78.74 270 top
R38  77.47,78.74 270 top
R39  90.17,78.74 270 top
R40  95.25,78.74 270 top
R41  64.77,78.74 270 top
R42  50.8,78.74 270 top
S1  19.05,83.82 0 top
S2  19.05,12.7 0 top
S3  36.83,5.08 90 top
S4  36.83,76.2 90 top
X1  6.35,8.89 0 top
X2  6.35,80.01 0 top

### Tracks (layer width: path | path; a pad name or v marks a point on that pad's centre or on a via)
N$1
  Bottom 0.813: J4.1 46.99,60.83 ARDUINO_DUE1.7
N$2
  Bottom 0.61: IC1.4 36.83,35.56 35.56,36.83 35.56,50.8 38.1,53.34 J3.5
N$3
  Bottom 0.813: J4.2 49.53,60.83 ARDUINO_DUE1.6
N$4
  Bottom 0.61: IC1.6 38.1,40.64 36.83,41.91 36.83,49.53 40.64,53.34 J3.6
N$5  (1 unrouted)
  Bottom 0.61: 44.06,46.99 R22.2 | IC1.7 40.64,43.18 44.45,46.99
N$6
  Bottom 0.61: IC1.5 43.18,38.1 R21.2
N$7  (1 unrouted)
  Bottom 0.61: IC1.9 30.48,40.64 29.21,41.91 29.21,45.72 27.94,46.99 26.67,46.99 | 26.67,46.99 26.45,46.99 R17.2 26.6,47.06 26.67,46.99
N$8  (1 unrouted)
  Bottom 0.813: IC1.11 31.34,35.56 29.49,37.41 27.25,37.41 26.67,36.83
N$9
  Bottom 0.61: R19.2 69.89,36.79 68.58,38.1 IC2.5
N$10
  Bottom 0.61: R20.2 68.58,48.26 66.04,48.26 64.77,46.99 IC2.7
N$11
  Bottom 0.61: R23.2 53.32,47.01 54.61,45.72 54.61,41.91 55.88,40.64 IC2.9
N$12
  Bottom 0.61: R24.2 53.34,35.56 IC2.11
N$13
  Bottom 0.813: IC1.2 40.64,30.48 41.91,29.21 41.91,26.67 45.72,22.86 55.88,22.86 64.77,13.97 64.77,12.57 ARDUINO_DUE1.A5 64.77,12.32 R13.1
N$14
  Bottom 0.813: LED1.A 66.04,5.08 R13.2
N$15  (1 unrouted)
  Bottom 0.813: 62.23,12.57 ARDUINO_DUE1.A4 62.23,12.32 R9.1 | IC1.1 39.37,26.67 45.72,20.32 55.88,20.32 62.23,13.97 62.23,12.7
N$16
  Bottom 0.813: R9.2 60.96,5.08 LED2.A
N$17
  Bottom 0.813: 52.07,12.32 ARDUINO_DUE1.A0 | IC1.14 31.9,26.26 43.49,14.52 49.84,14.52 52.07,12.7 51.94,12.57 ARDUINO_DUE1.A0 | R14.1 50.8,11.3 ARDUINO_DUE1.A0
N$18
  Bottom 0.813: 50.8,5.08 LED3.A R14.2
N$19
  Bottom 0.813: IC1.13 33.18,30.48 33.75,29.91 33.75,27.21 44.45,16.51 52.07,16.51 54.61,13.97 54.61,12.57 ARDUINO_DUE1.A1 54.61,12.32 R8.1
N$20
  Bottom 0.813: 87.5,21.72 ARDUINO_DUE1.DAC1 87.5,10.29 R2.1 | 87.5,21.72 85.09,24.13 73.66,24.13 67.31,30.48 IC2.2 | 87.5,21.72 87.63,21.59
N$21
  Bottom 0.813: IC2.1 67.31,27.94 73.66,21.59 82.55,21.59 85.09,19.05 85.09,12.57 ARDUINO_DUE1.DAC0 85.09,12.32 85.09,11.43 R1.1
N$22
  Bottom 0.813: IC2.14 64.77,20.32 68.58,20.32 74.93,13.97 74.8,13.84 ARDUINO_DUE1.A8 74.93,12.32 R5.1
N$23
  Bottom 0.813: LED4.A 55.88,5.08 R8.2
N$24
  Bottom 0.813: LED5.A 86.36,5.08 R2.2
N$25
  Bottom 0.813: R1.2 LED6.A
N$26
  Bottom 0.813: LED7.A 73.66,6.35 R5.2
N$27
  Bottom 0.813: IC2.13 58.42,30.48 66.04,22.86 69.85,22.86 77.47,15.24 77.47,12.57 ARDUINO_DUE1.A9 77.47,12.32 R10.1
N$28
  Bottom 0.813: LED8.A 77.47,5.08 R10.2
N$29
  Bottom 0.61: J3.3 33.02,44.45 IC1.8
N$30
  Bottom 0.813: J5.1 53.34,62.1 ARDUINO_DUE1.5
N$31
  Bottom 0.61: IC1.10 33.02,38.1 34.29,39.37 34.29,52.07 35.56,53.34 J3.4
N$32
  Bottom 0.61: IC2.4 63.5,35.56 62.23,36.83 62.18,36.83 61.52,37.49 61.52,51.51 59.69,53.34 J1.3
N$33
  Bottom 0.61: J1.4 62.23,53.34 63.5,52.07 63.5,45.27 62.83,44.49 62.88,41.45 63.96,40.66 64.75,40.66 IC2.6
N$34
  Bottom 0.61: IC2.8 57.15,50.8 54.61,53.34 J1.1
N$35
  Bottom 0.813: J5.2 55.88,62.1 ARDUINO_DUE1.4
N$36
  Bottom 0.813: J8.1 59.69,63.37 ARDUINO_DUE1.3
N$37
  Bottom 0.813: ARDUINO_DUE1.2 59.56,60.83 62.23,63.5 J8.2
N$38
  Bottom 0.61: J1.2 57.15,53.34 59.69,50.8 59.69,39.37 58.42,38.1 IC2.10
N$39
  Bottom 0.813: X1.1 3.83,5.05 6.35,2.54 6.36,2.54 6.88,2.02 19.8,2.02 20.32,2.54 | 20.32,2.54 21.59,3.81 IC4.1 24.13,7.62 24.13,19.05 C1.+ | 20.32,2.54 20.32,2.52 19.84,2.03 6.86,2.03 3.81,5.08 3.81,10.16 1.27,12.7 1.27,29.21 5.08,33.02 12.7,33.02 15.24,35.56 J7.5 12.7,46.99 8.89,50.8 8.89,63.5 12.61,67.93 74.84,67.93 76.2,66.04 J6.5
N$40
  Bottom 0.813: IC3.5 88.9,38.1 R3.2
N$41
  Bottom 0.813: J6.4 78.74,61.85 ARDUINO_DUE1.18
N$42
  Bottom 0.813: R4.2 86.44,47.07 85.09,45.72 IC3.7
N$43
  Bottom 0.813: IC3.2 91.44,30.48 92.71,29.21 92.71,12.57 | 92.71,12.57 ARDUINO_DUE1.CANTX | 92.71,12.57 92.84,12.57 R12.1
N$44
  Bottom 0.813: R12.2 95.25,5.08 LED9.A
N$45
  Bottom 0.813: IC3.1 88.9,27.94 90.17,26.67 90.17,12.57 ARDUINO_DUE1.CANRX 90.17,12.32 R11.1
N$46
  Bottom 0.813: R11.2 90.17,5.08 LED10.A
N$47
  Bottom 0.813: IC3.4 83.82,35.56 80.01,39.37 80.01,48.26 76.2,52.07 66.04,52.07 64.77,53.34 J1.5
N$48
  Bottom 0.813: J1.6 77.47,54.61 82.55,49.53 82.55,41.91 83.82,40.64 IC3.6
N$49
  Bottom 0.813: IC4.3 15.24,3.81 7.62,3.81 6.35,5.08 6.35,11.43 3.81,13.97 C2.+ 3.81,29.21 5.08,30.48 R6.1 13.97,30.48 19.05,35.56 19.05,46.99 26.67,54.61 J3.1
N$50  (via drill 1)
  other vias: 40.64,48.26
N$51  (1 unrouted)
  Bottom 0.61: J7.2 13.97,54.61 12.7,55.88 12.7,60.96 15.55,63.58 28.25,63.58 30.48,60.96 | 30.48,60.96 30.31,60.96 30.08,60.72 30.24,60.72 30.48,60.96
N$52  (1 unrouted)
  Bottom 0.813: S3.2 34.57,12.42 34.29,12.7 | 34.29,12.7 34.29,12.55 34.18,12.44 34.18,12.59 34.29,12.7 | 34.29,12.57 ARDUINO_DUE1.RESET | R6.2 19.05,30.48 34.29,15.24 34.29,12.7
N$53
  Bottom 0.813: C2.- C1.- 21.59,16.51 S2.3 21.59,8.89 19.05,6.35 IC4.2
N$54  (via drill 1)  (5 unrouted)
  Bottom 0.61: 67.31,33.02 68.58,33.02 69.85,34.29
  Bottom 0.813: R19.1 71.08,34.25 72.39,35.56 72.39,48.26 71.12,49.53 R20.1 | R24.1 R21.1 43.18,33.02 IC1.3 | 26.67,34.29 R18.1 22.86,34.29 | 22.86,34.29 21.59,35.56 21.59,46.99 24.13,49.53 26.67,49.53 | ARDUINO_DUE1.5V0 39.24,12.83 21.59,30.48 21.59,33.02 22.86,34.29 | R17.1 28.19,49.69 v29.86,51.04 | 40.64,48.26 41.9,49.52 R22.1 44.1,49.55 R23.1 52.07,49.86 52.07,55.88 54.61,58.42 88.9,58.42 90.17,57.15 90.17,49.53 91.44,49.53 92.71,48.26 92.71,35.56 91.44,34.29 R3.1 88.9,33.02 IC3.3 83.82,33.02 81.67,31.53 81.67,27.72 80.28,26.18 74.28,26.11 73.72,26.67 73.66,26.67 67.31,33.02 IC2.3
N$55  (2 unrouted)
  Bottom 0.813: J6.1 91.44,64.77 95.25,60.96 | 95,60.71 ARDUINO_DUE1.5V0_1 93.73,60.71 90.17,57.15 | J7.1 16.51,58.42 16.52,58.42 16.82,58.72 49.23,58.72 52.07,55.88
N$56
  Bottom 0.61: J7.4 13.97,49.53 10.92,51.99 10.92,62.15 14.62,66.08 29.58,66.06 33.02,60.96 32.89,60.96 ARDUINO_DUE1.12
N$57
  Bottom 0.813: ARDUINO_DUE1.19 82.42,60.83 83.82,62.23 J6.2
N$58
  Bottom 0.813: J6.3 81.28,66.04 82.55,67.31 96.52,67.31 99.98,62.7 99.98,19.4 ARDUINO_DUE1.GND_3
N$59  (6 unrouted)
  Bottom 0.61: 30.48,55.88 31.75,57.15 41.91,57.15 43.18,55.88 43.18,53.34 38.1,48.26 38.1,46.99 39.37,45.72 40.64,45.72 43.18,48.26 45.72,48.26 46.99,46.99 46.99,45.72 45.72,44.45 44.45,44.45 | 26.67,44.45 25.4,44.45 24.13,45.72 24.13,46.99 25.4,48.26 30.48,48.26 31.75,49.53 31.75,52.07 30.48,53.34 J3.2 | R18.3 25.4,39.37 24.13,38.1 24.13,36.83 25.4,35.56 27.94,35.56 29.21,34.29 29.21,33.02
  Bottom 0.813: 97.79,17.78 100.33,15.24 100.33,2.54 99.06,1.27 LED9.K LED10.K LED5.K LED6.K LED8.K LED7.K LED1.K LED2.K LED4.K LED3.K 45.72,1.27 44.45,2.54 | S3.3 39.09,2.82 39.37,2.82 | X1.2 8.89,8.89 12.7,12.7 | S2.2 19.05,11.43 17.78,12.7 12.7,12.7 | R3.3 90.17,44.19 R4.3 | R20.3 69.85,39.73 R19.3 | 52.07,44.45 52.04,44.48 R23.3 52.07,44.19 R24.3 R21.3 44.07,39.75 R22.3 | R18.3 26.33,44.11 26.67,44.45 | 44.45,2.54 44.45,12.7 | 39.37,2.82 44.17,2.82 44.45,2.54 | ARDUINO_DUE1.GND_1 42.16,12.45 27.94,26.67 27.94,31.75 29.21,33.02 31.75,33.02 | 12.7,12.7 6.35,19.05 6.35,25.4 8.89,27.94 19.05,27.94 26.67,20.32 26.67,8.89 30.48,5.08 37.11,5.08 39.37,2.82 | J3.2 30.48,55.88 29.21,57.15 25.4,57.15 20.32,52.07 J7.3
N$60  (1 unrouted)
  Bottom 0.61: 44.06,118.11 R27.2 | IC5.7 40.64,114.3 44.45,118.11
N$61
  Bottom 0.61: IC5.5 43.18,109.22 R26.2
N$62  (1 unrouted)
  Bottom 0.61: IC5.9 30.48,111.76 29.21,113.03 29.21,116.84 27.94,118.11 26.67,118.11 | 26.67,118.11 26.45,118.11 R7.2 26.6,118.18 26.67,118.11
N$63  (1 unrouted)
  Bottom 0.813: IC5.11 31.34,106.68 29.49,108.53 27.25,108.53 26.67,107.95
N$64
  Bottom 0.61: R16.2 69.89,107.91 68.58,109.22 IC7.5
N$65
  Bottom 0.61: R25.2 68.58,119.38 66.04,119.38 64.77,118.11 IC7.7
N$66
  Bottom 0.61: R28.2 53.32,118.13 54.61,116.84 54.61,113.03 55.88,111.76 IC7.9
N$67
  Bottom 0.61: R29.2 53.34,106.68 IC7.11
N$68
  Bottom 0.813: IC5.2 40.64,101.6 41.91,100.33 41.91,97.79 45.72,93.98 55.88,93.98 64.77,85.09 64.77,83.69 ARDUINO_DUE2.A5 64.77,83.44 R41.1
N$69  (1 unrouted)
  Bottom 0.813: 62.23,83.69 ARDUINO_DUE2.A4 62.23,83.44 R37.1 | IC5.1 39.37,97.79 45.72,91.44 55.88,91.44 62.23,85.09 62.23,83.82
N$70
  Bottom 0.813: 52.07,83.44 ARDUINO_DUE2.A0 | IC5.14 31.9,97.38 43.49,85.64 49.84,85.64 52.07,83.82 51.94,83.69 ARDUINO_DUE2.A0 | R42.1 50.8,82.42 ARDUINO_DUE2.A0
N$71
  Bottom 0.813: 50.8,76.2 LED12.A R42.2
N$72
  Bottom 0.813: IC5.13 33.18,101.6 33.75,101.03 33.75,98.33 44.45,87.63 52.07,87.63 54.61,85.09 54.61,83.69 ARDUINO_DUE2.A1 54.61,83.44 R36.1
N$73
  Bottom 0.813: 87.5,92.84 ARDUINO_DUE2.DAC1 87.5,81.41 R35.1 | 87.5,92.84 85.09,95.25 73.66,95.25 67.31,101.6 IC7.2 | 87.5,92.84 87.63,92.71
N$74
  Bottom 0.813: IC7.1 67.31,99.06 73.66,92.71 82.55,92.71 85.09,90.17 85.09,83.69 ARDUINO_DUE2.DAC0 85.09,83.44 85.09,82.55 R34.1
N$75
  Bottom 0.813: IC7.14 64.77,91.44 68.58,91.44 74.93,85.09 74.8,84.96 ARDUINO_DUE2.A8 74.93,83.44 R33.1
N$76
  Bottom 0.813: LED13.A 55.88,76.2 R36.2
N$77
  Bottom 0.813: LED14.A 86.36,76.2 R35.2
N$78
  Bottom 0.813: R34.2 LED15.A
N$79
  Bottom 0.813: LED16.A 73.66,77.47 R33.2
N$80
  Bottom 0.813: IC7.13 58.42,101.6 66.04,93.98 69.85,93.98 77.47,86.36 77.47,83.69 ARDUINO_DUE2.A9 77.47,83.44 R38.1
N$81
  Bottom 0.813: LED17.A 77.47,76.2 R38.2
N$82
  Bottom 0.813: LED11.A 66.04,76.2 R41.2
N$83
  Bottom 0.813: R37.2 60.96,76.2 LED18.A
N$84
  Bottom 0.61: IC5.4 36.83,106.68 35.56,107.95 35.56,121.92 38.1,124.46 J9.5
N$85
  Bottom 0.61: IC5.6 38.1,111.76 36.83,113.03 36.83,120.65 40.64,124.46 J9.6
N$86
  Bottom 0.61: IC5.10 33.02,109.22 34.29,110.49 34.29,123.19 35.56,124.46 J9.4
N$87
  Bottom 0.61: IC7.8 57.15,121.92 54.61,124.46 J2.1
N$88
  Bottom 0.61: J2.2 57.15,124.46 59.69,121.92 59.69,110.49 58.42,109.22 IC7.10
N$89
  Bottom 0.813: J12.1 46.99,131.95 ARDUINO_DUE2.7
N$90
  Bottom 0.813: J12.2 49.53,131.95 ARDUINO_DUE2.6
N$91
  Bottom 0.813: J13.1 53.34,133.22 ARDUINO_DUE2.5
N$92
  Bottom 0.813: J13.2 55.88,133.22 ARDUINO_DUE2.4
N$93
  Bottom 0.813: J14.1 59.69,134.49 ARDUINO_DUE2.3
N$94
  Bottom 0.813: ARDUINO_DUE2.2 59.56,131.95 62.23,134.62 J14.2
N$95
  Bottom 0.813: X2.1 3.83,76.17 6.35,73.66 6.36,73.66 6.88,73.14 19.8,73.14 20.32,73.66 | 20.32,73.66 21.59,74.93 IC6.1 24.13,78.74 24.13,90.17 C3.+ | 20.32,73.66 20.32,73.63 19.84,73.15 6.86,73.15 3.81,76.2 3.81,81.28 1.27,83.82 1.27,100.33 5.08,104.14 12.7,104.14 15.24,106.68 J11.5 12.7,118.11 8.89,121.92 8.89,134.62 12.61,139.05 74.84,139.05 76.2,137.16 J10.5
N$96
  Bottom 0.813: IC8.5 88.9,109.22 R30.2
N$97
  Bottom 0.813: R31.2 86.44,118.19 85.09,116.84 IC8.7
N$98
  Bottom 0.813: IC8.2 91.44,101.6 92.71,100.33 92.71,83.69 | 92.71,83.69 ARDUINO_DUE2.CANTX | 92.71,83.69 92.84,83.69 R40.1
N$99
  Bottom 0.813: R40.2 95.25,76.2 LED19.A
N$100
  Bottom 0.813: IC8.1 88.9,99.06 90.17,97.79 90.17,83.69 ARDUINO_DUE2.CANRX 90.17,83.44 R39.1
N$101
  Bottom 0.813: R39.2 90.17,76.2 LED20.A
N$102
  Bottom 0.813: IC8.4 83.82,106.68 80.01,110.49 80.01,119.38 76.2,123.19 66.04,123.19 64.77,124.46 J2.5
N$103
  Bottom 0.813: J2.6 77.47,125.73 82.55,120.65 82.55,113.03 83.82,111.76 IC8.6
N$104
  Bottom 0.813: IC6.3 15.24,74.93 7.62,74.93 6.35,76.2 6.35,82.55 3.81,85.09 C4.+ 3.81,100.33 5.08,101.6 R32.1 13.97,101.6 19.05,106.68 19.05,118.11 26.67,125.73 J9.1
N$105  (1 unrouted)
  Bottom 0.813: S4.2 34.57,83.54 34.29,83.82 | 34.29,83.82 34.29,83.67 34.18,83.56 34.18,83.71 34.29,83.82 | 34.29,83.69 ARDUINO_DUE2.RESET | R32.2 19.05,101.6 34.29,86.36 34.29,83.82
N$106
  Bottom 0.61: J2.4 62.23,124.46 63.5,123.19 63.5,116.38 62.83,115.61 62.88,112.57 63.96,111.77 64.75,111.77 IC7.6
N$107
  Bottom 0.61: IC7.4 63.5,106.68 62.23,107.95 62.18,107.95 61.52,108.61 61.52,122.63 59.69,124.46 J2.3
N$108
  Bottom 0.61: J9.3 33.02,115.57 IC5.8
N$109
  Bottom 0.813: C4.- C3.- 21.59,87.63 S1.3 21.59,80.01 19.05,77.47 IC6.2
N$110  (6 unrouted)
  Bottom 0.61: 30.48,127 31.75,128.27 41.91,128.27 43.18,127 43.18,124.46 38.1,119.38 38.1,118.11 39.37,116.84 40.64,116.84 43.18,119.38 45.72,119.38 46.99,118.11 46.99,116.84 45.72,115.57 44.45,115.57 | 26.67,115.57 25.4,115.57 24.13,116.84 24.13,118.11 25.4,119.38 30.48,119.38 31.75,120.65 31.75,123.19 30.48,124.46 J9.2 | R15.3 25.4,110.49 24.13,109.22 24.13,107.95 25.4,106.68 27.94,106.68 29.21,105.41 29.21,104.14
  Bottom 0.813: 97.79,88.9 100.33,86.36 100.33,73.66 99.06,72.39 LED19.K LED20.K LED14.K LED15.K LED17.K LED16.K LED11.K LED18.K LED13.K LED12.K 45.72,72.39 44.45,73.66 | S4.3 39.09,73.94 39.37,73.94 | X2.2 8.89,80.01 12.7,83.82 | S1.2 19.05,82.55 17.78,83.82 12.7,83.82 | R30.3 90.17,115.3 R31.3 | R25.3 69.85,110.85 R16.3 | 52.07,115.57 52.04,115.6 R28.3 52.07,115.31 R29.3 R26.3 44.07,110.87 R27.3 | R15.3 26.33,115.23 26.67,115.57 | 44.45,73.66 44.45,83.82 | 39.37,73.94 44.17,73.94 44.45,73.66 | ARDUINO_DUE2.GND_1 42.16,83.57 27.94,97.79 27.94,102.87 29.21,104.14 31.75,104.14 | 12.7,83.82 6.35,90.17 6.35,96.52 8.89,99.06 19.05,99.06 26.67,91.44 26.67,80.01 30.48,76.2 37.11,76.2 39.37,73.94 | J9.2 30.48,127 29.21,128.27 25.4,128.27 20.32,123.19 J11.3
N$111  (via drill 1)  (5 unrouted)
  Bottom 0.61: 67.31,104.14 68.58,104.14 69.85,105.41
  Bottom 0.813: R16.1 71.08,105.37 72.39,106.68 72.39,119.38 71.12,120.65 R25.1 | R29.1 R26.1 43.18,104.14 IC5.3 | 26.67,105.41 R15.1 22.86,105.41 | 22.86,105.41 21.59,106.68 21.59,118.11 24.13,120.65 26.67,120.65 | ARDUINO_DUE2.5V0 39.24,83.95 21.59,101.6 21.59,104.14 22.86,105.41 | R7.1 28.19,120.81 v29.86,122.16 | 40.64,119.38 41.9,120.64 R27.1 44.1,120.67 R28.1 52.07,120.97 52.07,127 54.61,129.54 88.9,129.54 90.17,128.27 90.17,120.65 91.44,120.65 92.71,119.38 92.71,106.68 91.44,105.41 R30.1 88.9,104.14 IC8.3 83.82,104.14 81.67,102.65 81.67,98.84 80.28,97.3 74.28,97.23 73.72,97.79 73.66,97.79 67.31,104.14 IC7.3
N$112  (2 unrouted)
  Bottom 0.813: J10.1 91.44,135.89 95.25,132.08 | 95,131.83 ARDUINO_DUE2.5V0_1 93.73,131.83 90.17,128.27 | J11.1 16.51,129.54 16.52,129.54 16.82,129.84 49.23,129.84 52.07,127
N$113  (1 unrouted)
  Bottom 0.61: J11.2 13.97,125.73 12.7,127 12.7,132.08 15.55,134.7 28.25,134.7 30.48,132.08 | 30.48,132.08 30.31,132.08 30.08,131.84 30.24,131.84 30.48,132.08
N$114
  Bottom 0.61: J11.4 13.97,120.65 10.92,123.1 10.92,133.27 14.62,137.2 29.58,137.18 33.02,132.08 32.89,132.08 ARDUINO_DUE2.12
N$115
  Bottom 0.813: J10.4 78.74,132.97 ARDUINO_DUE2.18
N$116
  Bottom 0.813: ARDUINO_DUE2.19 82.42,131.95 83.82,133.35 J10.2
N$117
  Bottom 0.813: J10.3 81.28,137.16 82.55,138.43 96.52,138.43 99.98,133.82 99.98,90.52 ARDUINO_DUE2.GND_3
N$118  (via drill 1)
  other vias: 40.64,119.38
V-  (1 unrouted)
  Bottom 0.61: IC1.12 34.29,33.02 35.56,31.75 35.56,27.94 35.6,27.94 45.06,18.48 53.91,18.48 58.42,13.97 58.42,9.49 59.9,8.26 71.33,8.3 72.39,9.16 | IC2.12 54.61,33.02 53.34,31.75 53.34,27.94 64.77,16.51 69.85,16.51 72.39,13.97 72.39,9.16 | 72.39,9.16 73.66,8.33 100.33,8.33
V-1  (1 unrouted)
  Bottom 0.61: IC5.12 34.29,104.14 35.56,102.87 35.56,99.06 35.6,99.06 45.06,89.6 53.91,89.6 58.42,85.09 58.42,80.61 59.9,79.38 71.33,79.42 72.39,80.28 | IC7.12 54.61,104.14 53.34,102.87 53.34,99.06 64.77,87.63 69.85,87.63 72.39,85.09 72.39,80.28 | 72.39,80.28 73.66,79.45 100.33,79.45

### Text on the board
Bottom: TRSKNCOE | TRSKNCOE